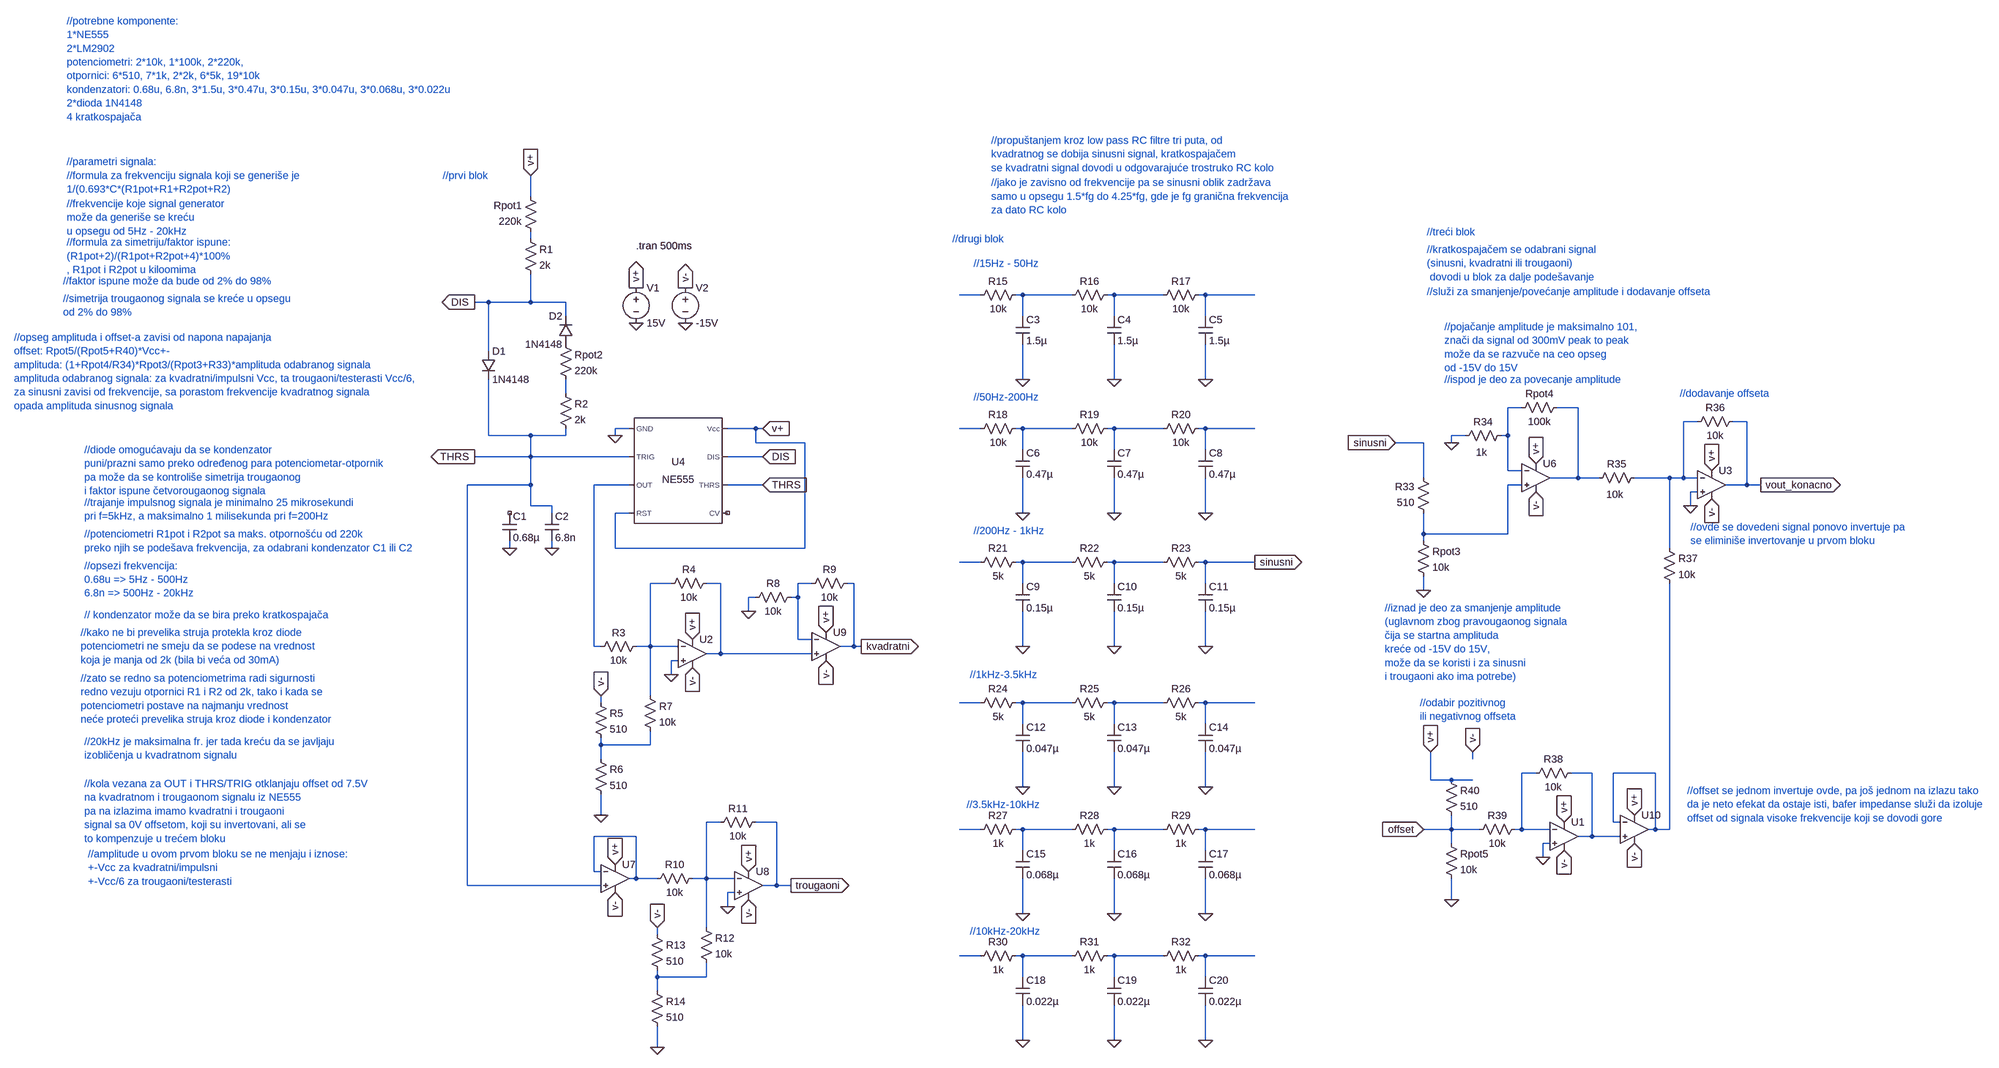
[diagram p0: schematic sema sa opisom funkcija.asc]
sema sa opisom funkcija.asc, the LTspice schematic file:
Version 4
SHEET 1 3212 2508
WIRE -1360 -400 -1360 -448
WIRE -1360 -304 -1360 -320
WIRE -336 -176 -384 -176
WIRE -240 -176 -256 -176
WIRE -128 -176 -240 -176
WIRE -32 -176 -48 -176
WIRE 80 -176 -32 -176
WIRE 176 -176 160 -176
WIRE 288 -176 176 -176
WIRE -1456 -160 -1488 -160
WIRE -1360 -160 -1360 -224
WIRE -1360 -160 -1456 -160
WIRE -1280 -160 -1360 -160
WIRE -1280 -128 -1280 -160
WIRE -240 -128 -240 -176
WIRE -32 -128 -32 -176
WIRE 176 -128 176 -176
WIRE -1456 -48 -1456 -160
WIRE -240 16 -240 -64
WIRE -32 16 -32 -64
WIRE 176 16 176 -64
WIRE -1280 48 -1280 16
WIRE 896 80 864 80
WIRE 1024 80 976 80
WIRE 1296 112 1264 112
WIRE 1408 112 1376 112
WIRE -1136 128 -1168 128
WIRE -848 128 -912 128
WIRE -832 128 -848 128
WIRE -336 128 -384 128
WIRE -240 128 -256 128
WIRE -128 128 -240 128
WIRE -32 128 -48 128
WIRE 80 128 -32 128
WIRE 176 128 160 128
WIRE 288 128 176 128
WIRE -1456 144 -1456 16
WIRE -1360 144 -1456 144
WIRE -1280 144 -1280 128
WIRE -1280 144 -1360 144
WIRE -1168 144 -1168 128
WIRE 768 144 736 144
WIRE 864 144 864 80
WIRE 864 144 848 144
WIRE -848 160 -848 128
WIRE -736 160 -848 160
WIRE 672 160 608 160
WIRE 736 160 736 144
WIRE -240 176 -240 128
WIRE -32 176 -32 128
WIRE 176 176 176 128
WIRE -1360 192 -1360 144
WIRE -1360 192 -1488 192
WIRE -1136 192 -1360 192
WIRE -832 192 -912 192
WIRE 864 224 864 144
WIRE 896 224 864 224
WIRE 672 240 672 160
WIRE 1024 240 1024 80
WIRE 1024 240 960 240
WIRE 1072 240 1024 240
WIRE 1232 240 1152 240
WIRE 1264 240 1264 112
WIRE 1264 240 1232 240
WIRE 1296 240 1264 240
WIRE -1360 256 -1360 192
WIRE -1360 256 -1504 256
WIRE -1136 256 -1216 256
WIRE -832 256 -912 256
WIRE 896 256 864 256
WIRE 1408 256 1408 112
WIRE 1408 256 1360 256
WIRE 1440 256 1408 256
WIRE 1296 272 1280 272
WIRE -1360 304 -1360 256
WIRE -1312 304 -1360 304
WIRE 1280 304 1280 272
WIRE -1312 320 -1312 304
WIRE -1136 320 -1168 320
WIRE -240 320 -240 240
WIRE -32 320 -32 240
WIRE 176 320 176 240
WIRE 672 368 672 320
WIRE 864 368 864 256
WIRE 864 368 672 368
WIRE 672 384 672 368
WIRE -1408 400 -1408 384
WIRE -1312 400 -1312 384
WIRE -1168 400 -1168 320
WIRE -736 400 -736 160
WIRE -736 400 -1168 400
WIRE 1232 400 1232 240
WIRE -336 432 -384 432
WIRE -240 432 -256 432
WIRE -128 432 -240 432
WIRE -32 432 -48 432
WIRE 80 432 -32 432
WIRE 176 432 160 432
WIRE 288 432 176 432
WIRE -1040 480 -1088 480
WIRE -928 480 -960 480
WIRE -720 480 -752 480
WIRE -624 480 -640 480
WIRE -240 480 -240 432
WIRE -32 480 -32 432
WIRE 176 480 176 432
WIRE 672 496 672 464
WIRE -848 512 -864 512
WIRE -752 512 -752 480
WIRE -752 512 -768 512
WIRE -864 544 -864 512
WIRE -752 608 -752 512
WIRE -720 608 -752 608
WIRE -1216 624 -1216 256
WIRE -1200 624 -1216 624
WIRE -1088 624 -1088 480
WIRE -1088 624 -1120 624
WIRE -1024 624 -1088 624
WIRE -624 624 -624 480
WIRE -624 624 -656 624
WIRE -608 624 -624 624
WIRE -240 624 -240 544
WIRE -32 624 -32 544
WIRE 176 624 176 544
WIRE -928 640 -928 480
WIRE -928 640 -960 640
WIRE -720 640 -928 640
WIRE -1024 656 -1040 656
WIRE -1040 688 -1040 656
WIRE -1088 736 -1088 624
WIRE -1200 752 -1200 736
WIRE -336 752 -384 752
WIRE -240 752 -256 752
WIRE -128 752 -240 752
WIRE -32 752 -48 752
WIRE 80 752 -32 752
WIRE 176 752 160 752
WIRE 288 752 176 752
WIRE -240 800 -240 752
WIRE -32 800 -32 752
WIRE 176 800 176 752
WIRE -1200 848 -1200 832
WIRE -1088 848 -1088 816
WIRE -1088 848 -1200 848
WIRE -1200 880 -1200 848
WIRE 784 880 784 864
WIRE 928 912 896 912
WIRE 1056 912 1008 912
WIRE 1200 912 1104 912
WIRE 688 928 688 864
WIRE 736 928 688 928
WIRE 784 928 736 928
WIRE -240 944 -240 864
WIRE -32 944 -32 864
WIRE 176 944 176 864
WIRE -1200 1008 -1200 960
WIRE -928 1024 -960 1024
WIRE -800 1024 -848 1024
WIRE 1104 1024 1104 912
WIRE 1120 1024 1104 1024
WIRE -336 1040 -384 1040
WIRE -240 1040 -256 1040
WIRE -128 1040 -240 1040
WIRE -32 1040 -48 1040
WIRE 80 1040 -32 1040
WIRE 176 1040 160 1040
WIRE 288 1040 176 1040
WIRE 736 1040 736 1008
WIRE 736 1040 672 1040
WIRE 800 1040 736 1040
WIRE 896 1040 896 912
WIRE 896 1040 880 1040
WIRE 960 1040 896 1040
WIRE 1200 1040 1200 912
WIRE 1200 1040 1184 1040
WIRE 1232 1040 1232 480
WIRE 1232 1040 1200 1040
WIRE -1120 1056 -1216 1056
WIRE 1056 1056 1056 912
WIRE 1056 1056 1024 1056
WIRE 1120 1056 1056 1056
WIRE 736 1072 736 1040
WIRE 960 1072 944 1072
WIRE -240 1088 -240 1040
WIRE -32 1088 -32 1040
WIRE 176 1088 176 1040
WIRE 944 1104 944 1072
WIRE -1216 1136 -1216 1056
WIRE -1200 1136 -1216 1136
WIRE -1120 1152 -1120 1056
WIRE -1120 1152 -1136 1152
WIRE -1072 1152 -1120 1152
WIRE -960 1152 -960 1024
WIRE -960 1152 -992 1152
WIRE -896 1152 -960 1152
WIRE -1504 1168 -1504 256
WIRE -1200 1168 -1504 1168
WIRE -800 1168 -800 1024
WIRE -800 1168 -832 1168
WIRE -768 1168 -800 1168
WIRE -896 1184 -912 1184
WIRE 736 1200 736 1152
WIRE -912 1216 -912 1184
WIRE -240 1232 -240 1152
WIRE -32 1232 -32 1152
WIRE 176 1232 176 1152
WIRE -960 1264 -960 1152
WIRE -1072 1280 -1072 1264
WIRE -336 1328 -384 1328
WIRE -240 1328 -256 1328
WIRE -128 1328 -240 1328
WIRE -32 1328 -48 1328
WIRE 80 1328 -32 1328
WIRE 176 1328 160 1328
WIRE 288 1328 176 1328
WIRE -1072 1376 -1072 1360
WIRE -960 1376 -960 1344
WIRE -960 1376 -1072 1376
WIRE -240 1376 -240 1328
WIRE -32 1376 -32 1328
WIRE 176 1376 176 1328
WIRE -1072 1408 -1072 1376
WIRE -240 1520 -240 1440
WIRE -32 1520 -32 1440
WIRE 176 1520 176 1440
WIRE -1072 1536 -1072 1488
FLAG -1120 -112 0
FLAG -1120 -192 v+
IOPIN -1120 -192 Out
FLAG 1440 256 vout_konacno
IOPIN 1440 256 Out
FLAG -832 256 THRS
IOPIN -832 256 In
FLAG -1488 192 THRS
IOPIN -1488 192 Out
FLAG -832 192 DIS
IOPIN -832 192 In
FLAG -832 128 v+
IOPIN -832 128 In
FLAG -1008 -112 0
FLAG -1008 -192 v-
IOPIN -1008 -192 Out
FLAG 736 160 0
FLAG 1328 224 v+
IOPIN 1328 224 In
FLAG 1328 288 v-
IOPIN 1328 288 In
FLAG 688 864 v+
IOPIN 688 864 In
FLAG 736 1200 0
FLAG 672 1040 offset
IOPIN 672 1040 In
FLAG 672 496 0
FLAG 784 864 v-
IOPIN 784 864 In
FLAG -32 1232 0
FLAG 176 1232 0
FLAG -240 944 0
FLAG -32 944 0
FLAG 176 944 0
FLAG -240 320 0
FLAG -32 320 0
FLAG 176 320 0
FLAG -768 1168 trougaoni
IOPIN -768 1168 Out
FLAG -1488 -160 DIS
IOPIN -1488 -160 Out
FLAG -240 1232 0
FLAG -1312 400 0
FLAG -1360 -448 v+
IOPIN -1360 -448 In
FLAG 928 208 v+
IOPIN 928 208 In
FLAG 928 272 v-
IOPIN 928 272 In
FLAG -1168 144 0
FLAG 1280 304 0
FLAG -992 608 v+
IOPIN -992 608 In
FLAG -992 672 v-
IOPIN -992 672 In
FLAG -1040 688 0
FLAG -1200 736 v-
IOPIN -1200 736 In
FLAG -1200 1008 0
FLAG -1168 1120 v+
IOPIN -1168 1120 In
FLAG -1168 1184 v-
IOPIN -1168 1184 In
FLAG -864 1136 v+
IOPIN -864 1136 In
FLAG -864 1200 v-
IOPIN -864 1200 In
FLAG -912 1216 0
FLAG -1072 1264 v-
IOPIN -1072 1264 In
FLAG -1072 1536 0
FLAG -608 624 kvadratni
IOPIN -608 624 Out
FLAG -32 1520 0
FLAG 176 1520 0
FLAG -240 1520 0
FLAG -1408 400 0
FLAG 608 160 sinusni
IOPIN 608 160 In
FLAG -688 592 v+
IOPIN -688 592 In
FLAG -688 656 v-
IOPIN -688 656 In
FLAG -240 16 0
FLAG -32 16 0
FLAG 176 16 0
FLAG -240 624 0
FLAG -32 624 0
FLAG 176 624 0
FLAG -864 544 0
FLAG 992 1024 v+
IOPIN 992 1024 In
FLAG 992 1088 v-
IOPIN 992 1088 In
FLAG 944 1104 0
FLAG 1152 1008 v+
IOPIN 1152 1008 In
FLAG 1152 1072 v-
IOPIN 1152 1072 In
FLAG 288 432 sinusni
IOPIN 288 432 Out
SYMBOL voltage -1120 -208 R0
WINDOW 123 0 0 Left 0
WINDOW 39 0 0 Left 0
SYMATTR InstName V1
SYMATTR Value 15V
SYMBOL res 992 64 R90
WINDOW 0 0 56 VBottom 2
WINDOW 3 32 56 VTop 2
SYMATTR InstName Rpot4
SYMATTR Value 100k
SYMBOL res 864 128 R90
WINDOW 0 0 56 VBottom 2
WINDOW 3 38 60 VTop 2
SYMATTR InstName R34
SYMATTR Value 1k
SYMBOL Misc\\NE555 -1024 224 R0
SYMATTR InstName U4
SYMBOL cap -1328 320 R0
SYMATTR InstName C2
SYMATTR Value 6.8n
SYMBOL res -1296 -80 R0
SYMATTR InstName Rpot2
SYMATTR Value 220k
SYMBOL voltage -1008 -208 R0
WINDOW 123 0 0 Left 0
WINDOW 39 0 0 Left 0
SYMATTR InstName V2
SYMATTR Value -15V
SYMBOL OpAmps\\UniversalOpAmp2 1328 256 R0
SYMATTR InstName U3
SYMBOL res 1168 224 R90
WINDOW 0 0 56 VBottom 2
WINDOW 3 38 60 VTop 2
SYMATTR InstName R35
SYMATTR Value 10k
SYMBOL res 720 1056 R0
SYMATTR InstName Rpot5
SYMATTR Value 10k
SYMBOL res 720 912 R0
SYMATTR InstName R40
SYMATTR Value 510
SYMBOL res 688 336 R180
WINDOW 0 36 76 Left 2
WINDOW 3 36 40 Left 2
SYMATTR InstName R33
SYMATTR Value 510
SYMBOL res 656 368 R0
SYMATTR InstName Rpot3
SYMATTR Value 10k
SYMBOL res -240 1024 R90
WINDOW 0 0 56 VBottom 2
WINDOW 3 32 56 VTop 2
SYMATTR InstName R27
SYMATTR Value 1k
SYMBOL cap -256 1088 R0
SYMATTR InstName C15
SYMATTR Value 0.068µ
SYMBOL res -1344 -304 R180
WINDOW 0 36 76 Left 2
WINDOW 3 36 40 Left 2
SYMATTR InstName Rpot1
SYMATTR Value 220k
SYMBOL cap -256 800 R0
SYMATTR InstName C12
SYMATTR Value 0.047µ
SYMBOL res -240 112 R90
WINDOW 0 0 56 VBottom 2
WINDOW 3 32 56 VTop 2
SYMATTR InstName R18
SYMATTR Value 10k
SYMBOL cap -256 176 R0
SYMATTR InstName C6
SYMATTR Value 0.47µ
SYMBOL cap -48 176 R0
SYMATTR InstName C7
SYMATTR Value 0.47µ
SYMBOL cap 160 176 R0
SYMATTR InstName C8
SYMATTR Value 0.47µ
SYMBOL res -32 112 R90
WINDOW 0 0 56 VBottom 2
WINDOW 3 32 56 VTop 2
SYMATTR InstName R19
SYMATTR Value 10k
SYMBOL res 176 112 R90
WINDOW 0 0 56 VBottom 2
WINDOW 3 32 56 VTop 2
SYMATTR InstName R20
SYMATTR Value 10k
SYMBOL res -32 1024 R90
WINDOW 0 0 56 VBottom 2
WINDOW 3 32 56 VTop 2
SYMATTR InstName R28
SYMATTR Value 1k
SYMBOL res 176 1024 R90
WINDOW 0 0 56 VBottom 2
WINDOW 3 32 56 VTop 2
SYMATTR InstName R29
SYMATTR Value 1k
SYMBOL res -32 736 R90
WINDOW 0 0 56 VBottom 2
WINDOW 3 32 56 VTop 2
SYMATTR InstName R25
SYMATTR Value 5k
SYMBOL res 176 736 R90
WINDOW 0 0 56 VBottom 2
WINDOW 3 32 56 VTop 2
SYMATTR InstName R26
SYMATTR Value 5k
SYMBOL cap -48 800 R0
SYMATTR InstName C13
SYMATTR Value 0.047µ
SYMBOL cap 160 800 R0
SYMATTR InstName C14
SYMATTR Value 0.047µ
SYMBOL cap -48 1088 R0
SYMATTR InstName C16
SYMATTR Value 0.068µ
SYMBOL cap 160 1088 R0
SYMATTR InstName C17
SYMATTR Value 0.068µ
SYMBOL res -240 736 R90
WINDOW 0 0 56 VBottom 2
WINDOW 3 32 56 VTop 2
SYMATTR InstName R24
SYMATTR Value 5k
SYMBOL res 1216 384 R0
SYMATTR InstName R37
SYMATTR Value 10k
SYMBOL OpAmps\\UniversalOpAmp2 928 240 R0
SYMATTR InstName U6
SYMBOL res 1280 128 R270
WINDOW 0 32 56 VTop 2
WINDOW 3 0 56 VBottom 2
SYMATTR InstName R36
SYMATTR Value 10k
SYMBOL OpAmps\\UniversalOpAmp2 -992 640 R0
SYMATTR InstName U2
SYMBOL res -1104 608 R90
WINDOW 0 0 56 VBottom 2
WINDOW 3 32 56 VTop 2
SYMATTR InstName R3
SYMATTR Value 10k
SYMBOL res -944 464 R90
WINDOW 0 0 56 VBottom 2
WINDOW 3 32 56 VTop 2
SYMATTR InstName R4
SYMATTR Value 10k
SYMBOL res -1104 720 R0
SYMATTR InstName R7
SYMATTR Value 10k
SYMBOL res -1216 864 R0
SYMATTR InstName R6
SYMATTR Value 510
SYMBOL res -1216 736 R0
SYMATTR InstName R5
SYMATTR Value 510
SYMBOL OpAmps\\UniversalOpAmp2 -1168 1152 R0
SYMATTR InstName U7
SYMBOL OpAmps\\UniversalOpAmp2 -864 1168 R0
SYMATTR InstName U8
SYMBOL res -976 1136 R90
WINDOW 0 0 56 VBottom 2
WINDOW 3 32 56 VTop 2
SYMATTR InstName R10
SYMATTR Value 10k
SYMBOL res -832 1008 R90
WINDOW 0 0 56 VBottom 2
WINDOW 3 32 56 VTop 2
SYMATTR InstName R11
SYMATTR Value 10k
SYMBOL res -976 1248 R0
SYMATTR InstName R12
SYMATTR Value 10k
SYMBOL res -1088 1392 R0
SYMATTR InstName R14
SYMATTR Value 510
SYMBOL res -1088 1264 R0
SYMATTR InstName R13
SYMATTR Value 510
SYMBOL res -240 1312 R90
WINDOW 0 0 56 VBottom 2
WINDOW 3 32 56 VTop 2
SYMATTR InstName R30
SYMATTR Value 1k
SYMBOL cap -256 1376 R0
SYMATTR InstName C18
SYMATTR Value 0.022µ
SYMBOL res -32 1312 R90
WINDOW 0 0 56 VBottom 2
WINDOW 3 32 56 VTop 2
SYMATTR InstName R31
SYMATTR Value 1k
SYMBOL res 176 1312 R90
WINDOW 0 0 56 VBottom 2
WINDOW 3 32 56 VTop 2
SYMATTR InstName R32
SYMATTR Value 1k
SYMBOL cap -1424 320 R0
SYMATTR InstName C1
SYMATTR Value 0.68µ
SYMBOL diode -1472 -48 R0
SYMATTR InstName D1
SYMATTR Value 1N4148
SYMBOL diode -1264 -64 R180
WINDOW 0 24 64 Left 2
WINDOW 3 24 0 Left 2
SYMATTR InstName D2
SYMATTR Value 1N4148
SYMBOL res -1376 -320 R0
SYMATTR InstName R1
SYMATTR Value 2k
SYMBOL res -1296 32 R0
SYMATTR InstName R2
SYMATTR Value 2k
SYMBOL cap -48 1376 R0
SYMATTR InstName C19
SYMATTR Value 0.022µ
SYMBOL cap 160 1376 R0
SYMATTR InstName C20
SYMATTR Value 0.022µ
SYMBOL OpAmps\\UniversalOpAmp2 -688 624 R0
SYMATTR InstName U9
SYMBOL res -624 464 R90
WINDOW 0 0 56 VBottom 2
WINDOW 3 32 56 VTop 2
SYMATTR InstName R9
SYMATTR Value 10k
SYMBOL res -240 -192 R90
WINDOW 0 0 56 VBottom 2
WINDOW 3 32 56 VTop 2
SYMATTR InstName R15
SYMATTR Value 10k
SYMBOL cap -256 -128 R0
SYMATTR InstName C3
SYMATTR Value 1.5µ
SYMBOL res -32 -192 R90
WINDOW 0 0 56 VBottom 2
WINDOW 3 32 56 VTop 2
SYMATTR InstName R16
SYMATTR Value 10k
SYMBOL res 176 -192 R90
WINDOW 0 0 56 VBottom 2
WINDOW 3 32 56 VTop 2
SYMATTR InstName R17
SYMATTR Value 10k
SYMBOL cap -48 -128 R0
SYMATTR InstName C4
SYMATTR Value 1.5µ
SYMBOL cap 160 -128 R0
SYMATTR InstName C5
SYMATTR Value 1.5µ
SYMBOL res -240 416 R90
WINDOW 0 0 56 VBottom 2
WINDOW 3 32 56 VTop 2
SYMATTR InstName R21
SYMATTR Value 5k
SYMBOL cap -256 480 R0
SYMATTR InstName C9
SYMATTR Value 0.15µ
SYMBOL res -32 416 R90
WINDOW 0 0 56 VBottom 2
WINDOW 3 32 56 VTop 2
SYMATTR InstName R22
SYMATTR Value 5k
SYMBOL cap -48 480 R0
SYMATTR InstName C10
SYMATTR Value 0.15µ
SYMBOL res 176 416 R90
WINDOW 0 0 56 VBottom 2
WINDOW 3 32 56 VTop 2
SYMATTR InstName R23
SYMATTR Value 5k
SYMBOL cap 160 480 R0
SYMATTR InstName C11
SYMATTR Value 0.15µ
SYMBOL res -752 496 R90
WINDOW 0 0 56 VBottom 2
WINDOW 3 32 56 VTop 2
SYMATTR InstName R8
SYMATTR Value 10k
SYMBOL OpAmps\\UniversalOpAmp2 992 1056 R0
SYMATTR InstName U1
SYMBOL res 896 1024 R90
WINDOW 0 0 56 VBottom 2
WINDOW 3 32 56 VTop 2
SYMATTR InstName R39
SYMATTR Value 10k
SYMBOL res 1024 896 R90
WINDOW 0 0 56 VBottom 2
WINDOW 3 32 56 VTop 2
SYMATTR InstName R38
SYMATTR Value 10k
SYMBOL OpAmps\\UniversalOpAmp2 1152 1040 R0
SYMATTR InstName U10
TEXT -1120 -288 Left 2 !.tran 500ms
TEXT 720 16 Left 2 ;//ispod je deo za povecanje amplitude
TEXT 1256 48 Left 2 ;//dodavanje offseta
TEXT 584 536 Left 2 ;//iznad je deo za smanjenje amplitude\n(uglavnom zbog pravougaonog signala \nčija se startna amplituda\nkreće od -15V do 15V,\nmože da se koristi i za sinusni\ni trougaoni ako ima potrebe)
TEXT 680 -280 Left 2 ;//kratkospajačem se odabrani signal \n(sinusni, kvadratni ili trougaoni)\n dovodi u blok za dalje podešavanje
TEXT 664 752 Left 2 ;//odabir pozitivnog \nili negativnog offseta
TEXT 720 -104 Left 2 ;//pojačanje amplitude je maksimalno 101,\nznači da signal od 300mV peak to peak\nmože da se razvuče na ceo opseg \nod -15V do 15V
TEXT -2536 -80 Left 2 ;//opseg amplituda i offset-a zavisi od napona napajanja\noffset: Rpot5/(Rpot5+R40)*Vcc+-\namplituda: (1+Rpot4/R34)*Rpot3/(Rpot3+R33)*amplituda odabranog signala\namplituda odabranog signala: za kvadratni/impulsni Vcc, ta trougaoni/testerasti Vcc/6,\nza sinusni zavisi od frekvencije, sa porastom frekvencije kvadratnog signala\nopada amplituda sinusnog signala
TEXT -2376 440 Left 2 ;//opsezi frekvencija:\n0.68u => 5Hz - 500Hz\n6.8n => 500Hz - 20kHz
TEXT -2376 936 Left 2 ;//kola vezana za OUT i THRS/TRIG otklanjaju offset od 7.5V \nna kvadratnom i trougaonom signalu iz NE555\npa na izlazima imamo kvadratni i trougaoni \nsignal sa 0V offsetom, koji su invertovani, ali se \nto kompenzuje u trećem bloku
TEXT -2416 -384 Left 2 ;//frekvencije koje signal generator \nmože da generiše se kreću \nu opsegu od 5Hz - 20kHz
TEXT -2376 176 Left 2 ;//diode omogućavaju da se kondenzator\npuni/prazni samo preko određenog para potenciometar-otpornik\npa može da se kontroliše simetrija trougaonog\ni faktor ispune četvorougaonog signala
TEXT -2384 592 Left 2 ;//kako ne bi prevelika struja protekla kroz diode\npotenciometri ne smeju da se podese na vrednost\nkoja je manja od 2k (bila bi veća od 30mA)
TEXT -2376 368 Left 2 ;//potenciometri R1pot i R2pot sa maks. otpornošću od 220k\npreko njih se podešava frekvencija, za odabrani kondenzator C1 ili C2
TEXT -2376 840 Left 2 ;//20kHz je maksimalna fr. jer tada kreću da se javljaju \nizobličenja u kvadratnom signalu
TEXT -2424 -168 Left 2 ;//simetrija trougaonog signala se kreće u opsegu\nod 2% do 98%
TEXT -2384 696 Left 2 ;//zato se redno sa potenciometrima radi sigurnosti\nredno vezuju otpornici R1 i R2 od 2k, tako i kada se\npotenciometri postave na najmanju vrednost\nneće proteći prevelika struja kroz diode i kondenzator
TEXT -2424 -208 Left 2 ;//faktor ispune može da bude od 2% do 98%
TEXT -2376 552 Left 2 ;// kondenzator može da se bira preko kratkospajača
TEXT -2416 -296 Left 2 ;//formula za simetriju/faktor ispune:\n(R1pot+2)/(R1pot+R2pot+4)*100%\n, R1pot i R2pot u kiloomima
TEXT -2416 -800 Left 2 ;//potrebne komponente:\n1*NE555\n2*LM2902\npotenciometri: 2*10k, 1*100k, 2*220k,\notpornici: 6*510, 7*1k, 2*2k, 6*5k, 19*10k\nkondenzatori: 0.68u, 6.8n, 3*1.5u, 3*0.47u, 3*0.15u, 3*0.047u, 3*0.068u, 3*0.022u\n2*dioda 1N4148\n4 kratkospajača
TEXT -1560 -448 Left 2 ;//prvi blok
TEXT -2368 1096 Left 2 ;//amplitude u ovom prvom bloku se ne menjaju i iznose:\n+-Vcc za kvadratni/impulsni\n+-Vcc/6 za trougaoni/testerasti
TEXT -2376 296 Left 2 ;//trajanje impulsnog signala je minimalno 25 mikrosekundi\npri f=5kHz, a maksimalno 1 milisekunda pri f=200Hz
TEXT -2416 -448 Left 2 ;//formula za frekvenciju signala koji se generiše je \n1/(0.693*C*(R1pot+R1+R2pot+R2)
TEXT -400 -304 Left 2 ;//drugi blok
TEXT -352 56 Left 2 ;//50Hz-200Hz
TEXT -360 688 Left 2 ;//1kHz-3.5kHz
TEXT -368 984 Left 2 ;//3.5kHz-10kHz
TEXT -360 1272 Left 2 ;//10kHz-20kHz
TEXT -312 -528 Left 2 ;//propuštanjem kroz low pass RC filtre tri puta, od\nkvadratnog se dobija sinusni signal, kratkospajačem\nse kvadratni signal dovodi u odgovarajuće trostruko RC kolo
TEXT -312 -432 Left 2 ;//jako je zavisno od frekvencije pa se sinusni oblik zadržava \nsamo u opsegu 1.5*fg do 4.25*fg, gde je fg granična frekvencija \nza dato RC kolo
TEXT 680 -320 Left 2 ;//treći blok
TEXT 680 -184 Left 2 ;//služi za smanjenje/povećanje amplitude i dodavanje offseta
TEXT -352 -248 Left 2 ;//15Hz - 50Hz
TEXT -352 360 Left 2 ;//200Hz - 1kHz
TEXT 1272 952 Left 2 ;//offset se jednom invertuje ovde, pa još jednom na izlazu tako\nda je neto efekat da ostaje isti, bafer impedanse služi da izoluje\noffset od signala visoke frekvencije koji se dovodi gore
TEXT 1280 352 Left 2 ;//ovde se dovedeni signal ponovo invertuje pa\nse eliminiše invertovanje u prvom bloku
TEXT -2416 -480 Left 2 ;//parametri signala:

The netlist it stands for:
* sema sa opisom funkcija.asc
V1 v+ 0 15V
Rpot4 N008 N007 100k
R34 N007 0 1k
XU4 0 THRS N014 v+ NC_01 THRS DIS v+ NE555  ; pins GND TRIG OUT RST CV THRS DIS Vcc
C2 THRS 0 6.8n
Rpot2 P001 N006 220k
V2 v- 0 -15V
XU3 0 N009 v+ v- vout_konacno level2 Avol=1Meg GBW=10Meg Slew=10Meg Ilimit=25m Rail=0 Vos=0 En=0 Enk=0 In=0 Ink=0 Rin=500Meg  ; pins In+ In- V+ V- OUT
R35 N009 N008 10k
Rpot5 offset 0 10k
R40 v+ offset 510
R33 N015 sinusni 510
Rpot3 N015 0 10k
R27 N032 N031 1k
C15 N032 0 0.068µ
Rpot1 N001 v+ 220k
C12 N023 0 0.047µ
R18 N011 N010 10k
C6 N011 0 0.47µ
C7 N012 0 0.47µ
C8 N013 0 0.47µ
R19 N012 N011 10k
R20 N013 N012 10k
R28 N033 N032 1k
R29 N034 N033 1k
R25 N024 N023 5k
R26 N025 N024 5k
C13 N024 0 0.047µ
C14 N025 0 0.047µ
C16 N033 0 0.068µ
C17 N034 0 0.068µ
R24 N023 N022 5k
R37 N009 N029 10k
XU6 N015 N007 v+ v- N008 level2 Avol=1Meg GBW=10Meg Slew=10Meg Ilimit=25m Rail=0 Vos=0 En=0 Enk=0 In=0 Ink=0 Rin=500Meg  ; pins In+ In- V+ V- OUT
R36 N009 vout_konacno 10k
XU2 0 N019 v+ v- N020 level2 Avol=1Meg GBW=10Meg Slew=10Meg Ilimit=25m Rail=0 Vos=0 En=0 Enk=0 In=0 Ink=0 Rin=500Meg  ; pins In+ In- V+ V- OUT
R3 N019 N014 10k
R4 N020 N019 10k
R7 N019 N026 10k
R6 N026 0 510
R5 v- N026 510
XU7 THRS N035 v+ v- N035 level2 Avol=1Meg GBW=10Meg Slew=10Meg Ilimit=25m Rail=0 Vos=0 En=0 Enk=0 In=0 Ink=0 Rin=500Meg  ; pins In+ In- V+ V- OUT
XU8 0 N030 v+ v- trougaoni level2 Avol=1Meg GBW=10Meg Slew=10Meg Ilimit=25m Rail=0 Vos=0 En=0 Enk=0 In=0 Ink=0 Rin=500Meg  ; pins In+ In- V+ V- OUT
R10 N030 N035 10k
R11 trougaoni N030 10k
R12 N030 N040 10k
R14 N040 0 510
R13 v- N040 510
R30 N037 N036 1k
C18 N037 0 0.022µ
R31 N038 N037 1k
R32 N039 N038 1k
C1 NC_02 0 0.68µ
D1 DIS THRS 1N4148
D2 P001 DIS 1N4148
R1 N001 DIS 2k
R2 N006 THRS 2k
C19 N038 0 0.022µ
C20 N039 0 0.022µ
XU9 N020 N021 v+ v- kvadratni level2 Avol=1Meg GBW=10Meg Slew=10Meg Ilimit=25m Rail=0 Vos=0 En=0 Enk=0 In=0 Ink=0 Rin=500Meg  ; pins In+ In- V+ V- OUT
R9 kvadratni N021 10k
R15 N003 N002 10k
C3 N003 0 1.5µ
R16 N004 N003 10k
R17 N005 N004 10k
C4 N004 0 1.5µ
C5 N005 0 1.5µ
R21 N017 N016 5k
C9 N017 0 0.15µ
R22 N018 N017 5k
C10 N018 0 0.15µ
R23 sinusni N018 5k
C11 sinusni 0 0.15µ
R8 N021 0 10k
XU1 0 N027 v+ v- N028 level2 Avol=1Meg GBW=10Meg Slew=10Meg Ilimit=25m Rail=0 Vos=0 En=0 Enk=0 In=0 Ink=0 Rin=500Meg  ; pins In+ In- V+ V- OUT
R39 N027 offset 10k
R38 N028 N027 10k
XU10 N028 N029 v+ v- N029 level2 Avol=1Meg GBW=10Meg Slew=10Meg Ilimit=25m Rail=0 Vos=0 En=0 Enk=0 In=0 Ink=0 Rin=500Meg  ; pins In+ In- V+ V- OUT
.model D D
.lib standard.dio
.tran 500ms
* //ispod je deo za povecanje amplitude
* //dodavanje offseta
* //iznad je deo za smanjenje amplitude
* (uglavnom zbog pravougaonog signala
* čija se startna amplituda
* kreće od -15V do 15V,
* može da se koristi i za sinusni
* i trougaoni ako ima potrebe)
* //kratkospajačem se odabrani signal
* (sinusni, kvadratni ili trougaoni)
*  dovodi u blok za dalje podešavanje
* //odabir pozitivnog
* ili negativnog offseta
* //pojačanje amplitude je maksimalno 101,
* znači da signal od 300mV peak to peak
* može da se razvuče na ceo opseg
* od -15V do 15V
* //opseg amplituda i offset-a zavisi od napona napajanja
* offset: Rpot5/(Rpot5+R40)*Vcc+-
* amplituda: (1+Rpot4/R34)*Rpot3/(Rpot3+R33)*amplituda odabranog signala
* amplituda odabranog signala: za kvadratni/impulsni Vcc, ta trougaoni/testerasti Vcc/6,
* za sinusni zavisi od frekvencije, sa porastom frekvencije kvadratnog signala
* opada amplituda sinusnog signala
* //opsezi frekvencija:
* 0.68u => 5Hz - 500Hz
* 6.8n => 500Hz - 20kHz
* //kola vezana za OUT i THRS/TRIG otklanjaju offset od 7.5V
* na kvadratnom i trougaonom signalu iz NE555
* pa na izlazima imamo kvadratni i trougaoni
* signal sa 0V offsetom, koji su invertovani, ali se
* to kompenzuje u trećem bloku
* //frekvencije koje signal generator
* može da generiše se kreću
* u opsegu od 5Hz - 20kHz
* //diode omogućavaju da se kondenzator
* puni/prazni samo preko određenog para potenciometar-otpornik
* pa može da se kontroliše simetrija trougaonog
* i faktor ispune četvorougaonog signala
* //kako ne bi prevelika struja protekla kroz diode
* potenciometri ne smeju da se podese na vrednost
* koja je manja od 2k (bila bi veća od 30mA)
* //potenciometri R1pot i R2pot sa maks. otpornošću od 220k
* preko njih se podešava frekvencija, za odabrani kondenzator C1 ili C2
* //20kHz je maksimalna fr. jer tada kreću da se javljaju
* izobličenja u kvadratnom signalu
* //simetrija trougaonog signala se kreće u opsegu
* od 2% do 98%
* //zato se redno sa potenciometrima radi sigurnosti
* redno vezuju otpornici R1 i R2 od 2k, tako i kada se
* potenciometri postave na najmanju vrednost
* neće proteći prevelika struja kroz diode i kondenzator
* //faktor ispune može da bude od 2% do 98%
* // kondenzator može da se bira preko kratkospajača
* //formula za simetriju/faktor ispune:
* (R1pot+2)/(R1pot+R2pot+4)*100%
* , R1pot i R2pot u kiloomima
* //potrebne komponente:
* 1*NE555
* 2*LM2902
* potenciometri: 2*10k, 1*100k, 2*220k,
* otpornici: 6*510, 7*1k, 2*2k, 6*5k, 19*10k
* kondenzatori: 0.68u, 6.8n, 3*1.5u, 3*0.47u, 3*0.15u, 3*0.047u, 3*0.068u, 3*0.022u
* 2*dioda 1N4148
* 4 kratkospajača
* //prvi blok
* //amplitude u ovom prvom bloku se ne menjaju i iznose:
* +-Vcc za kvadratni/impulsni
* +-Vcc/6 za trougaoni/testerasti
* //trajanje impulsnog signala je minimalno 25 mikrosekundi
* pri f=5kHz, a maksimalno 1 milisekunda pri f=200Hz
* //formula za frekvenciju signala koji se generiše je
* 1/(0.693*C*(R1pot+R1+R2pot+R2)
* //drugi blok
* //50Hz-200Hz
* //1kHz-3.5kHz
* //3.5kHz-10kHz
* //10kHz-20kHz
* //propuštanjem kroz low pass RC filtre tri puta, od
* kvadratnog se dobija sinusni signal, kratkospajačem
* se kvadratni signal dovodi u odgovarajuće trostruko RC kolo
* //jako je zavisno od frekvencije pa se sinusni oblik zadržava
* samo u opsegu 1.5*fg do 4.25*fg, gde je fg granična frekvencija
* za dato RC kolo
* //treći blok
* //služi za smanjenje/povećanje amplitude i dodavanje offseta
* //15Hz - 50Hz
* //200Hz - 1kHz
* //offset se jednom invertuje ovde, pa još jednom na izlazu tako
* da je neto efekat da ostaje isti, bafer impedanse služi da izoluje
* offset od signala visoke frekvencije koji se dovodi gore
* //ovde se dovedeni signal ponovo invertuje pa
* se eliminiše invertovanje u prvom bloku
* //parametri signala:
.lib NE555.sub
.lib UniversalOpAmp2.lib
.backanno
.end